# EAGLE design THlp (EAGLE 8.0.1)
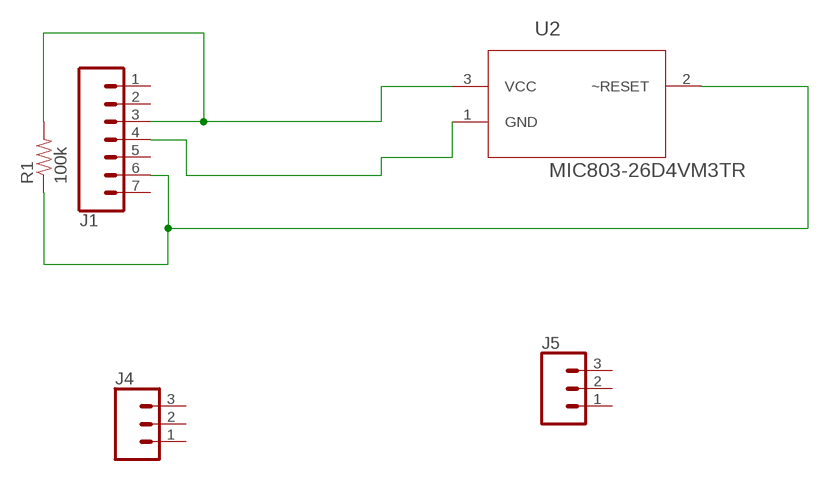
[diagram p0: schematic, sheet 1]

## Parts
J1  CONN_07  [1X07]
J4  CONN_03PTH  [1X03]
J5  CONN_03PTH  [1X03]
R1  100k  RESISTOR0603-RES  [0603-RES]
U2  MIC803-26D4VM3TR  [SOT95P232X110-3N]

## Nets
N$1: J1.4 U2.1(GND)
N$2: J1.3 R1.2 U2.3(VCC)
N$3: J1.6 R1.1 U2.2(~RESET)
Unconnected: J1.1 J1.2 J1.5 J1.7 J4.1 J4.2 J4.3 J5.1 J5.2 J5.3

## Library data of the parts
J1 = SparkFun-Connectors:CONN_07: Header 7 Standard 7-pin 0.1" header. Use with straight break away headers (SKU : PRT-00116), right angle break away headers (PRT-00553), swiss pins (PRT-00743), machine pins (PRT-00117), and female headers (PRT-00115). NOTES ON THE VARIANTS LOCK and LOCK_LONGPADS... This footprint was designed to help hold the alignment of a through-hole component (i.e. 7-pin header) while soldering it into place. You may notice that each hole has been shifted either up or down by 0.005 of an inch from it's more standard position (which is usually a perfectly straight line). This slight alteration caused the pins (the squares in the middle) to touch the edges of the holes. Because they are alternating, it causes a "brace" to hold the header in place. 0.005 has proven to be the perfect amount of "off-center" position when using our standard breakaway headers. Although looks a little odd when you look at the bare footprint, once you have a header in there, the alteration is very hard to notice. Also, if you push a header all the way into place, it is covered up entirely on the bottom side. This idea of altering the position of holes to aid alignment will be further integrated into the Sparkfun Library for other footprints. It can help hold any component with 3 or more connection pins.
J4 J5 = SparkFun-Connectors:CONN_03: Header 3 Standard 3-pin 0.1" header. Use with straight break away headers (SKU : PRT-00116), right angle break away headers (PRT-00553), swiss pins (PRT-00743), machine pins (PRT-00117), and female headers (PRT-00115). Molex polarized connector foot print use with SKU : PRT-08232 with associated crimp pins and housings.
R1 = SparkFun-Passives:RESISTOR: Resistor Basic schematic elements and footprints for 0603, 1206, and PTH resistors.
U2 = Micrel_By_element14_Batch_1:MIC803-26D4VM3TR: 3 Pin Microprocessor Supervisor Circuit with Open Drain Reset Output; MPN: MIC803-26D4VM3TR; OC_FARNELL: 1924763; OC_NEWARK: 58T4945; PACKAGE: SOT-23-3; SUPPLIER: MICREL SEMICONDUCTOR

## Board
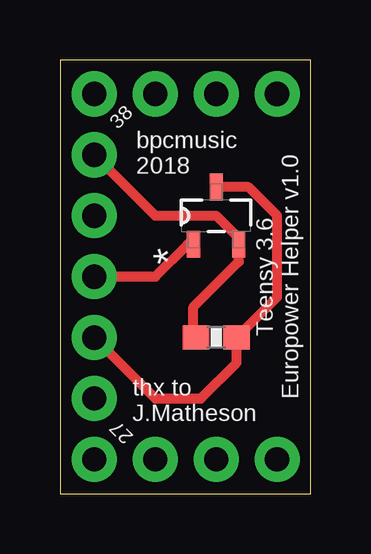
[diagram p1: board, top side]
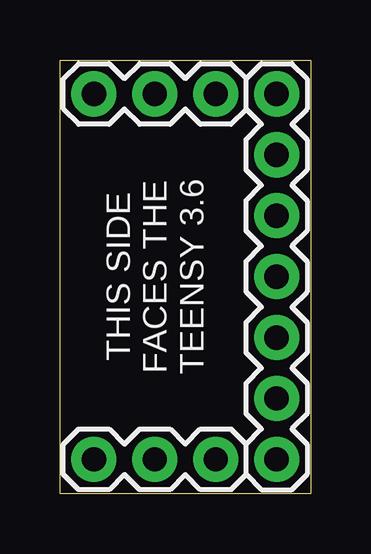
[diagram p2: board, bottom side, seen from below]

Size 10.46 x 18.09 mm. Coordinates in mm from the lower left corner, seen from the top.
Outline: 0,0 10.46,0 10.46,18.08 0,18.08 0,0
Copper layers (1*16): Top 0.035559375mm / dielectric 1.6mm / Bottom 0.035559375mm
Design rules "oshpark-2layer (1)": minimum track width 6mil, minimum drill 10mil, track to track 6mil, track to pad 6mil, pad to pad 6mil, via to via 6mil, smd to smd 6mil, copper to edge 15mil, drill to drill 6mil, minimum pad ring 5mil, minimum via ring 5mil, stop-mask expansion 2.5mil, vias tented up to drill 0mil, thermal gap 10mil

### Footprints (pad centres in the part's own frame; a part is rotated, then mirrored left to right if it is on the bottom)
1X07 = drill 1.016 pad 1.88: 1 0,0; 2 2.54,0; 3 5.08,0; 4 7.62,0; 5 10.16,0; 6 12.7,0; 7 15.24,0
1X03 = drill 1.016 pad 1.88: 1 0,0; 2 2.54,0; 3 5.08,0
0603-RES = smd 1.1 x 1: 1 -0.85,0; 2 0.85,0
SOT95P232X110-3N = smd 1.118 x 0.559: 1 -1.194,0.94; 2 -1.194,-0.94; 3 1.194,0

### Placement (x,y rotation side)
J1  1.43,1.43 90 bottom
J4  3.97,16.67 180 bottom
J5  3.97,1.43 180 bottom
R1  6.51,6.51 0 top
U2  6.51,11.59 90 top

### Tracks (layer width: path | path; a pad name or v marks a point on that pad's centre or on a via)
N$1
  Top 0.406: U2.1 5.31,10.39 3.97,9.05 J1.4
N$2
  Top 0.406: U2.3 7.85,12.78 9.05,11.59 9.05,8.2 R1.2 7.36,5.45 5.87,3.97 3.97,3.97 J1.3
N$3
  Top 0.406: U2.2 7.45,9.99 | U2.2 7.45,10.65 6.51,11.59 3.97,11.59 J1.6 | R1.1 5.56,6.61 5.56,7.78 7.45,9.67 U2.2

### Text on the board
tNames: 38 | bpcmusic / 2018 | Teensy 3.6 / Europower Helper v1.0 | 27 | thx to / J.Matheson
bNames: THIS SIDE / FACES THE / TEENSY 3.6